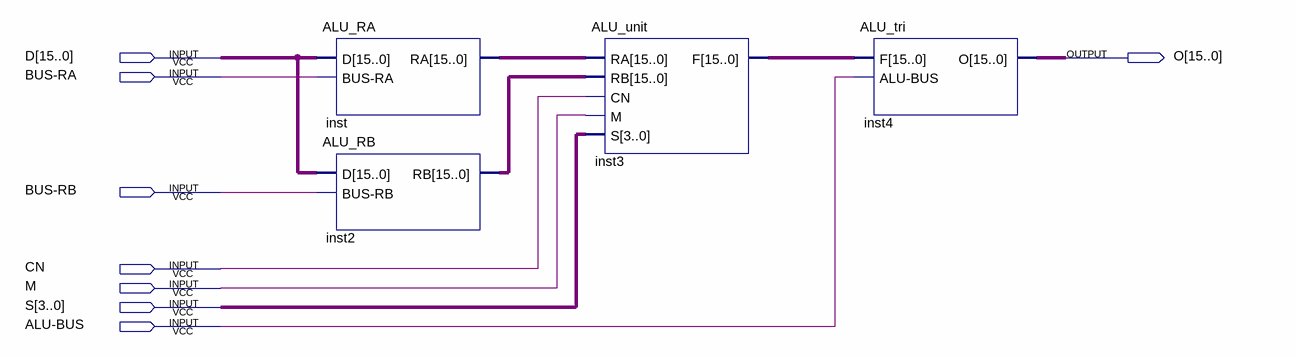
[diagram p0: schematic sheet]
// Quartus schematic ALU.bdf as structural Verilog: 4 symbols, 8 pins
module ALU (
  input  [15:0] D,
  input  \BUS-RA ,
  input  \BUS-RB ,
  input  CN,
  input  M,
  input  [3:0] S,
  input  \ALU-BUS ,
  output [15:0] O
);

  wire [15:0] inst2_rb, inst3_f, inst_ra;

  ALU_RA inst (.D(D), .\BUS-RA (\BUS-RA ), .RA(inst_ra));
  ALU_RB inst2 (.D(D), .\BUS-RB (\BUS-RB ), .RB(inst2_rb));
  ALU_unit inst3 (.RA(inst_ra), .RB(inst2_rb), .CN(CN), .M(M), .S(S), .F(inst3_f));
  ALU_tri inst4 (.F(inst3_f), .\ALU-BUS (\ALU-BUS ), .O(O));
endmodule
